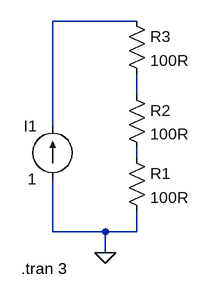
[diagram p0: schematic Reihe.asc]
Reihe.asc, the LTspice schematic file:
Version 4
SHEET 1 880 680
WIRE 176 -96 48 -96
WIRE 176 16 176 -16
WIRE 48 64 48 -96
WIRE 176 112 176 96
WIRE 48 224 48 144
WIRE 128 224 48 224
WIRE 176 224 176 192
WIRE 176 224 128 224
WIRE 128 256 128 224
FLAG 128 256 0
SYMBOL res 160 0 R0
SYMATTR InstName R2
SYMATTR Value 100R
SYMBOL res 160 -112 R0
SYMATTR InstName R3
SYMATTR Value 100R
SYMBOL current 48 144 R180
WINDOW 0 24 80 Left 2
WINDOW 3 24 0 Left 2
WINDOW 123 0 0 Left 2
WINDOW 39 0 0 Left 2
SYMATTR InstName I1
SYMATTR Value 1
SYMBOL res 160 96 R0
SYMATTR InstName R1
SYMATTR Value 100R
TEXT 0 280 Left 2 !.tran 3

The netlist it stands for:
* Reihe.asc
R2 N002 N003 100R
R3 N001 N002 100R
I1 0 N001 1
R1 N003 0 100R
.tran 3
.backanno
.end